# Altium schematic sheet Control_Board_add.SchDoc
size A
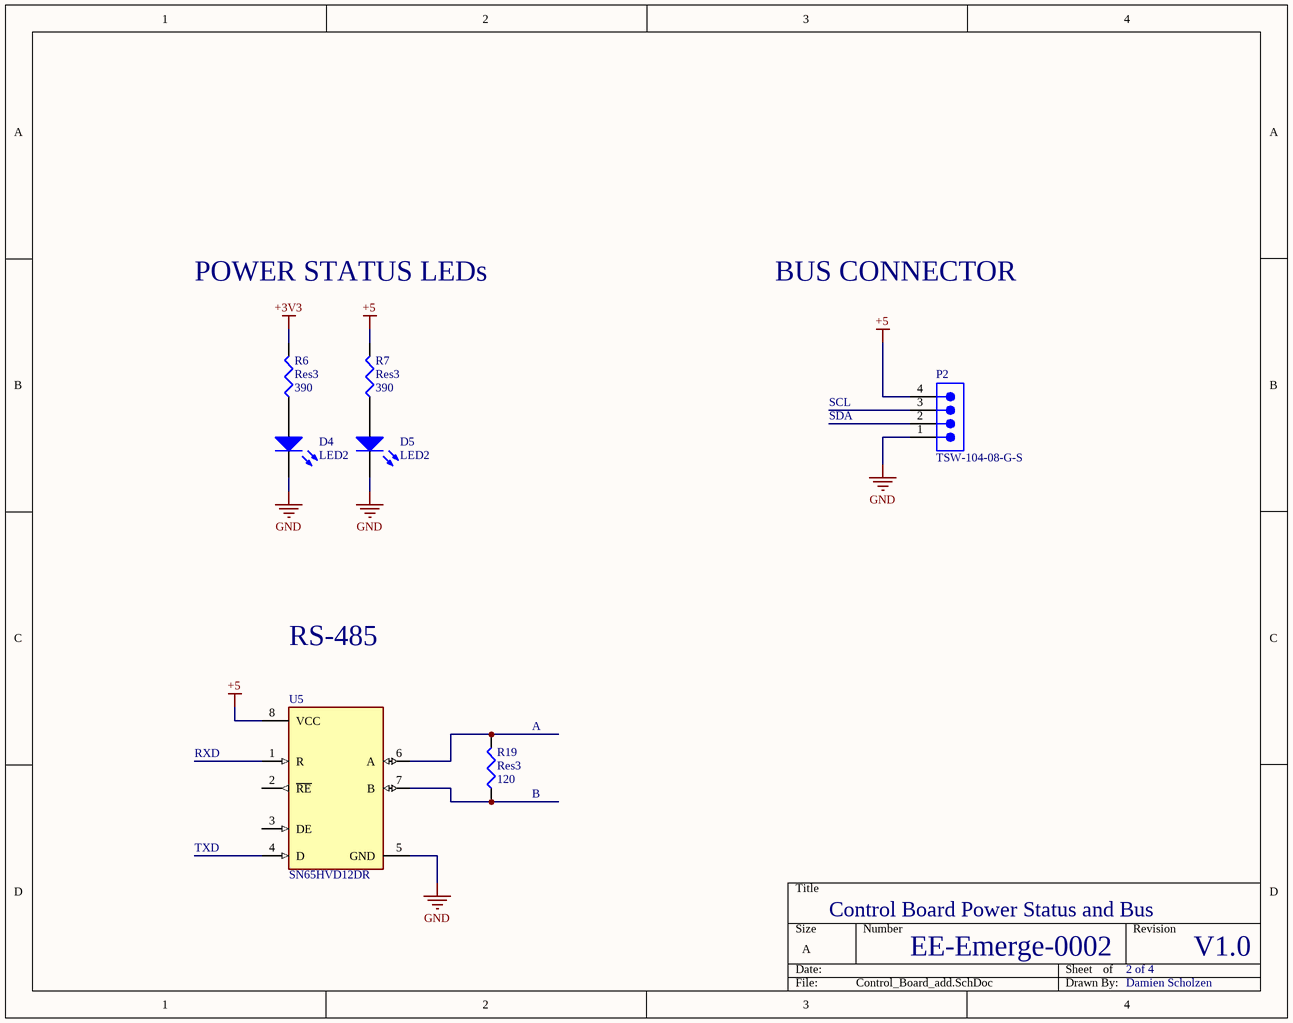
[diagram p0: Control_Board_add.SchDoc]

## Parts
D4  LED2  [3.2X1.6X1.1]
D5  LED2  [3.2X1.6X1.1]
P2  TSW-104-08-G-S  [SMTC-TSW-104-08-X-S]
R6  Res3  value 390  [6-0805_N]
R7  Res3  value 390  [6-0805_N]
R19  Res3  value 120  [6-0805_N]
U5  SN65HVD12DR  [FP-D0008A-MFG]

## Nets
+3V3: R6.2
+5: P2.4 R7.2 U5.8(VCC)
GND: D4.2(K) D5.2(K) P2.1 U5.5(GND)
NetD4_1: D4.1(A) R6.1
NetD5_1: D5.1(A) R7.1
NetR19_1: R19.1 U5.7(B)
NetR19_2: R19.2 U5.6(A)

Not connected (* = marked no-connect by the designer): P2 2 3; U5 1(R) 2(~{RE}) 3(DE) 4(D)

## Notes on the sheet
- POWER STATUS LEDs
- BUS CONNECTOR
- SCL
- SDA
- RS-485
- RXD
- (near R19) A
- (near R19) B
- TXD
- Control Board Power Status and Bus
- EE-Emerge-0002
- 2 of 4
- V1.0
- Damien Scholzen

## Library data of the parts
D4 D5 = LED2: Typical RED, GREEN, YELLOW, AMBER GaAs LED; Published: 8-Jun-2000; LatestRevisionDate: 17-Jul-2002; LatestRevisionNote: Re-released for DXP Platform.; PackageVersion: Feb-2002; PackageReference: 3.2X1.6X1.1; Publisher: Altium Limited; PackageDescription: SM LED; 2 Flat Leads
P2 = CMP-1024-00357-1: 0.025" SQ Post Header, Through-hole, Vertical, -55 to 125 degC, 2.54 mm Pitch, 4-Pin, Male, RoHS; Manufacturer: Samtec; Pitch: 2.54 mm; RoHS: True; ComponentLink3URL: http://www.samtec.com/documents/webfiles/cpdf/TSW-XXX-XX-XXX-X-XX-XXX-MKT.pdf; Mounting Technology: Through-hole; ComponentLink2URL: http://www.samtec.com/documents/webfiles/pdf/TSW_TH.PDF; ComponentLink1URL: http://www.samtec.com; ComponentLink3Description: Package Specification; PackageVersion: DM, 8/1988; ComponentLink2Description: Datasheet; PackageReference: TSW-104-08-X-S; PackageDescription: .025[0.64] SQ. Post Terminal Strip Assembly; PartNumber: TSW-104-08-G-S; ComponentLink1Description: Manufacturer URL; Temperature Range: -55 to 125 degC; DatasheetVersion: F-214; Orientation: Vertical
R6 R7 R19 = Res3_4: Resistor; Published: 8-Jun-2000; LatestRevisionDate: 29-May-2009; LatestRevisionNote: IPC-7351 Footprint Added.; PackageReference: J1-0603; Publisher: Altium Limited; PackageDescription: Chip Resistor
U5 = CMP-04875-000007-1: IC TRANSCEIVER HALF 1/1 8SOIC; Manufacturer: Texas Instruments; Standoff Height: 0.11mm; Max Supply Voltage: 3.6V; Simplex Duplex: Half Duplex; Min Supply Voltage: 3V; Number Of Receivers: 1; Description: Single Transmitter/Receiver RS-485 8-Pin SOIC T/R; Interface: RS-485,RS-422; Max Junction Temp: +145°C; Nominal Supply Current: 9mA; Data Rate: 1Mbits/s; Manufacturer Part Number: SN65HVD12DR; Digikey Description: IC TRANSCEIVER HALF 1/1 8SOIC; Category: IC; Octopart: https://octopart.com/sn65hvd12dr-texas+instruments-713591; RoHS: TRUE; Temperature Range Low: -40°C; Device Class L2: Interface ICs; Device Class L3: RS-232 / RS-422 / RS-485 Interface ICs; Lead Free: Yes; Mouser Description: RS-485 Interface IC 3.3V Differential Transceivers; Ambient Temperature Range Low: -40°C; Number Of Transmitters: 1; Ipc Land Pattern Name: SOIC127P600X175-8; Temperature Range High: +85°C; ComponentLink2URL: http://www.ti.com/lit/ds/symlink/sn65hvd12.pdf; Package: D0008A; ComponentLink2Description: Datasheet; Height: 1.75mm; Automotive: No; Device Class L1: Integrated Circuits (ICs); Temperature: -40°C to +85°C; Ambient Temperature Range High: +85°C